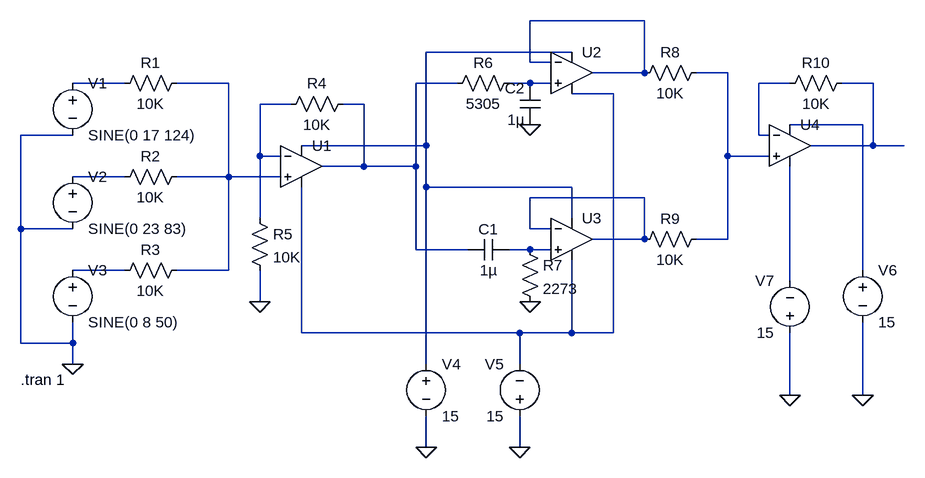
[diagram p0: schematic 50HzAttenuator(active).asc]
50HzAttenuator(active).asc, the LTspice schematic file:
Version 4.1
SHEET 1 1284 680
WIRE 880 -112 704 -112
WIRE 768 -64 544 -64
WIRE 704 -48 704 -112
WIRE 736 -48 704 -48
WIRE 880 -32 880 -112
WIRE 880 -32 800 -32
WIRE 1008 -32 960 -32
WIRE 80 -16 0 -16
WIRE 240 -16 160 -16
WIRE 592 -16 528 -16
WIRE 704 -16 672 -16
WIRE 736 -16 704 -16
WIRE 1104 -16 1056 -16
WIRE 1232 -16 1184 -16
WIRE 832 0 768 0
WIRE 336 16 288 16
WIRE 448 16 416 16
WIRE 1216 48 1104 48
WIRE 0 64 -80 64
WIRE 1056 64 1056 -16
WIRE 1072 64 1056 64
WIRE 544 80 544 -64
WIRE 544 80 352 80
WIRE 1232 80 1232 -16
WIRE 1232 80 1136 80
WIRE 1280 80 1232 80
WIRE 288 96 288 16
WIRE 320 96 288 96
WIRE 1008 96 1008 -32
WIRE 1072 96 1008 96
WIRE 448 112 448 16
WIRE 448 112 384 112
WIRE 528 112 528 -16
WIRE 528 112 448 112
WIRE 80 128 0 128
WIRE 240 128 240 -16
WIRE 240 128 160 128
WIRE 320 128 240 128
WIRE 544 144 544 80
WIRE 768 144 544 144
WIRE 880 160 704 160
WIRE 288 192 288 96
WIRE 768 192 768 144
WIRE -80 208 -80 64
WIRE 0 208 -80 208
WIRE 704 208 704 160
WIRE 736 208 704 208
WIRE 880 224 880 160
WIRE 880 224 800 224
WIRE 1008 224 1008 96
WIRE 1008 224 960 224
WIRE 528 240 528 112
WIRE 608 240 528 240
WIRE 704 240 672 240
WIRE 736 240 704 240
WIRE 80 272 0 272
WIRE 240 272 240 128
WIRE 240 272 160 272
WIRE 1216 272 1216 48
WIRE 1104 288 1104 112
WIRE 288 320 288 272
WIRE 352 368 352 144
WIRE 688 368 352 368
WIRE 768 368 768 256
WIRE 768 368 688 368
WIRE 832 368 832 0
WIRE 832 368 768 368
WIRE -80 384 -80 208
WIRE 0 384 0 352
WIRE 0 384 -80 384
WIRE 0 416 0 384
WIRE 544 416 544 144
WIRE 688 416 688 368
WIRE 1104 464 1104 368
WIRE 1216 464 1216 352
WIRE 544 544 544 496
WIRE 688 544 688 496
FLAG 0 416 0
FLAG 288 320 0
FLAG 704 48 0
FLAG 704 320 0
FLAG 544 544 0
FLAG 688 544 0
FLAG 1216 464 0
FLAG 1104 464 0
SYMBOL voltage 0 -32 R0
WINDOW 123 0 0 Left 0
WINDOW 39 0 0 Left 0
SYMATTR InstName V1
SYMATTR Value SINE(0 17 124)
SYMBOL voltage 0 112 R0
WINDOW 123 0 0 Left 0
WINDOW 39 0 0 Left 0
SYMATTR InstName V2
SYMATTR Value SINE(0 23 83)
SYMBOL voltage 0 256 R0
WINDOW 123 0 0 Left 0
WINDOW 39 0 0 Left 0
SYMATTR InstName V3
SYMATTR Value SINE(0 8 50)
SYMBOL OpAmps\\UniversalOpAmp 352 112 R0
SYMATTR InstName U1
SYMBOL res 176 -32 R90
WINDOW 0 0 56 VBottom 2
WINDOW 3 32 56 VTop 2
SYMATTR InstName R1
SYMATTR Value 10K
SYMATTR SpiceLine tol=1 pwr=0.1
SYMBOL res 176 112 R90
WINDOW 0 0 56 VBottom 2
WINDOW 3 32 56 VTop 2
SYMATTR InstName R2
SYMATTR Value 10K
SYMATTR SpiceLine tol=1 pwr=0.1
SYMBOL res 176 256 R90
WINDOW 0 0 56 VBottom 2
WINDOW 3 32 56 VTop 2
SYMATTR InstName R3
SYMATTR Value 10K
SYMATTR SpiceLine tol=1 pwr=0.1
SYMBOL res 432 0 R90
WINDOW 0 0 56 VBottom 2
WINDOW 3 32 56 VTop 2
SYMATTR InstName R4
SYMATTR Value 10K
SYMATTR SpiceLine tol=1 pwr=0.1
SYMBOL res 272 176 R0
SYMATTR InstName R5
SYMATTR Value 10K
SYMATTR SpiceLine tol=1 pwr=0.1
SYMBOL OpAmps\\UniversalOpAmp 768 -32 R0
SYMATTR InstName U2
SYMBOL OpAmps\\UniversalOpAmp 768 224 R0
SYMATTR InstName U3
SYMBOL res 688 -32 R90
WINDOW 0 0 56 VBottom 2
WINDOW 3 32 56 VTop 2
SYMATTR InstName R6
SYMATTR Value 5305
SYMBOL cap 672 224 R90
WINDOW 0 0 32 VBottom 2
WINDOW 3 32 32 VTop 2
SYMATTR InstName C1
SYMATTR Value 1µ
SYMATTR SpiceLine V=4 Irms=0 Rser=0 Lser=0 mfg="Murata" pn="GRM032R60G105ME05" type="X5R"
SYMBOL cap 720 48 R180
WINDOW 0 24 56 Left 2
WINDOW 3 24 8 Left 2
SYMATTR InstName C2
SYMATTR Value 1µ
SYMATTR SpiceLine V=4 Irms=0 Rser=0 Lser=0 mfg="Murata" pn="GRM032R60G105ME05" type="X5R"
SYMBOL res 688 224 R0
SYMATTR InstName R7
SYMATTR Value 2273
SYMBOL res 976 -48 R90
WINDOW 0 0 56 VBottom 2
WINDOW 3 32 56 VTop 2
SYMATTR InstName R8
SYMATTR Value 10K
SYMATTR SpiceLine tol=1 pwr=0.1
SYMBOL res 976 208 R90
WINDOW 0 0 56 VBottom 2
WINDOW 3 32 56 VTop 2
SYMATTR InstName R9
SYMATTR Value 10K
SYMATTR SpiceLine tol=1 pwr=0.1
SYMBOL OpAmps\\UniversalOpAmp 1104 80 R0
SYMATTR InstName U4
SYMBOL res 1200 -32 R90
WINDOW 0 0 56 VBottom 2
WINDOW 3 32 56 VTop 2
SYMATTR InstName R10
SYMATTR Value 10K
SYMATTR SpiceLine tol=1 pwr=0.1
SYMBOL voltage 544 400 R0
WINDOW 123 0 0 Left 0
WINDOW 39 0 0 Left 0
SYMATTR InstName V4
SYMATTR Value 15
SYMBOL voltage 688 512 R180
WINDOW 0 24 96 Left 2
WINDOW 3 24 16 Left 2
WINDOW 123 0 0 Left 0
WINDOW 39 0 0 Left 0
SYMATTR InstName V5
SYMATTR Value 15
SYMBOL voltage 1216 256 R0
WINDOW 123 0 0 Left 0
WINDOW 39 0 0 Left 0
SYMATTR InstName V6
SYMATTR Value 15
SYMBOL voltage 1104 384 R180
WINDOW 0 24 96 Left 2
WINDOW 3 24 16 Left 2
WINDOW 123 0 0 Left 0
WINDOW 39 0 0 Left 0
SYMATTR InstName V7
SYMATTR Value 15
TEXT -80 440 Left 2 !.tran 1

The netlist it stands for:
* 50HzAttenuator(active).asc
V1 N004 0 SINE(0 17 124)
V2 N013 0 SINE(0 23 83)
V3 N016 0 SINE(0 8 50)
X§U1 N005 N011 N002 N010 N006 level1 Avol=1Meg GBW=10Meg Vos=0 En=0 Enk=0 In=0 Ink=0 Rin=500Meg  ; pins In+ In- V+ V- OUT
R1 N005 N004 10K tol=1 pwr=0.1
R2 N005 N013 10K tol=1 pwr=0.1
R3 N005 N016 10K tol=1 pwr=0.1
R4 N006 N011 10K tol=1 pwr=0.1
R5 N011 0 10K tol=1 pwr=0.1
X§U2 N007 N001 N002 N010 N001 level1 Avol=1Meg GBW=10Meg Vos=0 En=0 Enk=0 In=0 Ink=0 Rin=500Meg  ; pins In+ In- V+ V- OUT
X§U3 N015 N014 N002 N010 N014 level1 Avol=1Meg GBW=10Meg Vos=0 En=0 Enk=0 In=0 Ink=0 Rin=500Meg  ; pins In+ In- V+ V- OUT
R6 N007 N006 5305
C1 N015 N006 1µ V=4 Irms=0 Rser=0 Lser=0 mfg="Murata" pn="GRM032R60G105ME05" type="X5R"
C2 0 N007 1µ V=4 Irms=0 Rser=0 Lser=0 mfg="Murata" pn="GRM032R60G105ME05" type="X5R"
R7 N015 0 2273
R8 N003 N001 10K tol=1 pwr=0.1
R9 N003 N014 10K tol=1 pwr=0.1
X§U4 N003 N008 N012 N017 N009 level1 Avol=1Meg GBW=10Meg Vos=0 En=0 Enk=0 In=0 Ink=0 Rin=500Meg  ; pins In+ In- V+ V- OUT
R10 N009 N008 10K tol=1 pwr=0.1
V4 N002 0 15
V5 0 N010 15
V6 N012 0 15
V7 0 N017 15
.tran 1
.lib UniversalOpAmp1.lib
.backanno
.end